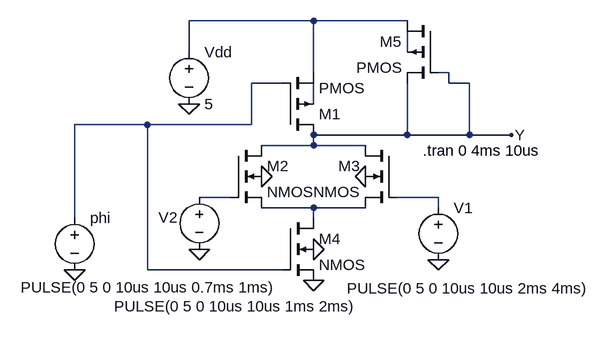
[diagram p0: schematic DynamicNOR.asc]
DynamicNOR.asc, the LTspice schematic file:
Version 4
SHEET 1 880 680
WIRE 224 -16 32 -16
WIRE 368 -16 224 -16
WIRE 32 32 32 -16
WIRE 368 32 368 0
WIRE 224 64 224 -16
WIRE 432 64 416 64
WIRE 176 80 128 80
WIRE 432 80 432 64
WIRE 464 80 432 80
WIRE 224 112 224 80
WIRE -32 144 -144 144
WIRE 128 144 128 80
WIRE 128 144 -32 144
WIRE 368 160 368 80
WIRE 368 160 224 160
WIRE 464 160 464 80
WIRE 464 160 368 160
WIRE 528 160 464 160
WIRE 224 176 224 160
WIRE 224 176 144 176
WIRE 304 176 224 176
WIRE 96 256 48 256
WIRE 416 256 352 256
WIRE 224 272 144 272
WIRE 304 272 224 272
WIRE 416 272 416 256
WIRE -144 288 -144 144
WIRE 224 288 224 272
WIRE -32 368 -32 144
WIRE 176 368 -32 368
FLAG 32 112 0
FLAG 224 384 0
FLAG 416 352 0
FLAG -144 368 0
FLAG 48 336 0
FLAG 144 224 0
FLAG 304 224 0
FLAG 224 336 0
FLAG 528 160 Y
SYMBOL pmos4 176 160 M180
SYMATTR InstName M1
SYMATTR Value2 l=2 w=10
SYMBOL nmos4 96 176 R0
SYMATTR InstName M2
SYMATTR Value2 l=2 w=10
SYMBOL nmos4 352 176 M0
SYMATTR InstName M3
SYMATTR Value2 l=2 w=10
SYMBOL nmos4 176 288 R0
SYMATTR InstName M4
SYMATTR Value2 l=2 w=10
SYMBOL voltage 416 256 R0
WINDOW 3 -141 140 Left 2
WINDOW 123 0 0 Left 2
WINDOW 39 0 0 Left 2
SYMATTR Value PULSE(0 5 0 10us 10us 2ms 4ms)
SYMATTR InstName V1
SYMBOL voltage 48 240 R0
WINDOW 0 -63 47 Left 2
WINDOW 3 -131 184 Left 2
WINDOW 123 0 0 Left 2
WINDOW 39 0 0 Left 2
SYMATTR InstName V2
SYMATTR Value PULSE(0 5 0 10us 10us 1ms 2ms)
SYMBOL voltage -144 272 R0
WINDOW 3 -83 123 Left 2
WINDOW 123 0 0 Left 2
WINDOW 39 0 0 Left 2
SYMATTR Value PULSE(0 5 0 10us 10us 0.7ms 1ms)
SYMATTR InstName phi
SYMBOL voltage 32 16 R0
WINDOW 123 0 0 Left 2
WINDOW 39 0 0 Left 2
SYMATTR InstName Vdd
SYMATTR Value 5
SYMBOL pmos4 416 -16 M0
SYMATTR InstName M5
SYMATTR Value2 l=20 w=1
TEXT 392 184 Left 2 !.tran 0 4ms 10us

The netlist it stands for:
* DynamicNOR.asc
M1 Y N003 N001 N004 PMOS l=2 w=10
M2 Y N005 N007 0 NMOS l=2 w=10
M3 Y N006 N007 0 NMOS l=2 w=10
M4 N007 N003 0 0 NMOS l=2 w=10
V1 N006 0 PULSE(0 5 0 10us 10us 2ms 4ms)
V2 N005 0 PULSE(0 5 0 10us 10us 1ms 2ms)
V§phi N003 0 PULSE(0 5 0 10us 10us 0.7ms 1ms)
Vdd N001 0 5
M5 N001 Y Y N002 PMOS l=20 w=1
.model NMOS NMOS
.model PMOS PMOS
.lib standard.mos
.tran 0 4ms 10us
.backanno
.end